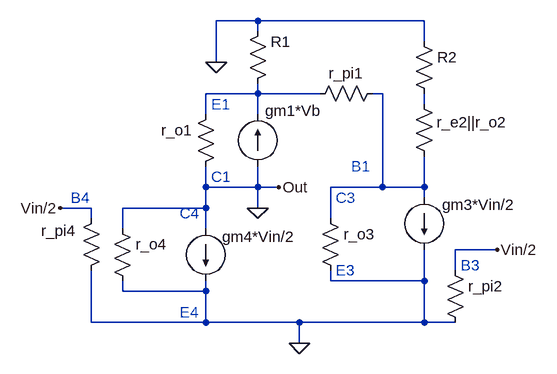
[diagram p0: schematic differential_stage.asc]
differential_stage.asc, the LTspice schematic file:
Version 4
SHEET 1 880 680
WIRE 256 -320 192 -320
WIRE 512 -320 256 -320
WIRE 256 -304 256 -320
WIRE 512 -288 512 -320
WIRE 192 -256 192 -320
WIRE 256 -208 256 -224
WIRE 256 -208 176 -208
WIRE 352 -208 256 -208
WIRE 448 -208 432 -208
WIRE 512 -192 512 -208
WIRE 176 -176 176 -208
WIRE 256 -176 256 -208
WIRE 176 -64 176 -96
WIRE 256 -64 256 -96
WIRE 256 -64 176 -64
WIRE 288 -64 256 -64
WIRE 448 -64 448 -208
WIRE 448 -64 368 -64
WIRE 512 -64 512 -112
WIRE 512 -64 448 -64
WIRE 512 -48 512 -64
WIRE 0 -32 -48 -32
WIRE 176 -32 176 -64
WIRE 176 -32 48 -32
WIRE 256 -32 256 -64
WIRE 0 -16 0 -32
WIRE 368 -16 368 -64
WIRE 48 0 48 -32
WIRE 176 0 176 -32
WIRE 624 32 560 32
WIRE 560 64 560 32
WIRE 368 80 368 64
WIRE 512 80 512 32
WIRE 512 80 368 80
WIRE 48 96 48 80
WIRE 176 96 176 80
WIRE 176 96 48 96
WIRE 0 144 0 64
WIRE 176 144 176 96
WIRE 176 144 0 144
WIRE 320 144 176 144
WIRE 512 144 512 80
WIRE 512 144 320 144
WIRE 560 144 512 144
WIRE 320 176 320 144
FLAG 320 176 0
FLAG 256 -32 0
FLAG 288 -64 Out
FLAG -48 -32 Vin/2
FLAG 624 32 Vin/2
FLAG 192 -256 0
SYMBOL res 16 -32 M0
WINDOW 0 39 35 Left 2
SYMATTR InstName r_pi4
SYMATTR Value ""
SYMBOL res 32 -16 R0
WINDOW 3 36 68 Left 2
SYMATTR Value ""
SYMATTR InstName r_o4
SYMBOL res 192 -192 M0
WINDOW 3 36 68 Left 2
SYMATTR Value ""
SYMATTR InstName r_o1
SYMBOL res 448 -224 R90
WINDOW 0 0 56 VBottom 2
WINDOW 3 32 56 VTop 2
SYMATTR InstName r_pi1
SYMATTR Value ""
SYMBOL res 496 -208 R0
WINDOW 0 35 44 Left 2
SYMATTR InstName r_e2||r_o2
SYMATTR Value ""
SYMBOL current 176 0 R0
WINDOW 0 25 12 Left 2
SYMATTR InstName gm4*Vin/2
SYMATTR Value ""
SYMBOL current 256 -96 M180
WINDOW 0 11 86 Left 2
WINDOW 3 24 0 Left 2
SYMATTR InstName gm1*Vb
SYMATTR Value ""
SYMBOL current 512 -48 R0
WINDOW 0 28 11 Left 2
SYMATTR InstName gm3*Vin/2
SYMATTR Value ""
SYMBOL res 352 -32 R0
SYMATTR InstName r_o3
SYMATTR Value ""
SYMBOL res 544 48 R0
SYMATTR InstName r_pi2
SYMATTR Value ""
SYMBOL res 240 -208 M180
WINDOW 0 36 80 Left 2
WINDOW 3 36 19 Left 2
SYMATTR InstName R1
SYMATTR Value ""
SYMBOL res 496 -304 R0
SYMATTR InstName R2
SYMATTR Value ""
TEXT -32 -48 Left 2 ;B4
TEXT 136 128 Left 2 ;E4
TEXT 136 -24 Left 2 ;C4
TEXT 568 56 Left 2 ;B3
TEXT 376 64 Left 2 ;E3
TEXT 376 -48 Left 2 ;C3
TEXT 184 -80 Left 2 ;C1
TEXT 184 -192 Left 2 ;E1
TEXT 400 -96 Left 2 ;B1

The netlist it stands for:
* differential_stage.asc
r_pi4 Vin/2 0
r_o4 0 0
r_o1 N001 0
r_pi1 N002 N001
r_e2||r_o2 N003 N002
I§gm4*Vin/2 0 0
I§gm1*Vb 0 N001
I§gm3*Vin/2 N002 0
r_o3 N002 0
r_pi2 Vin/2 0
R1 N001 0
R2 0 N003
* B4
* E4
* C4
* B3
* E3
* C3
* C1
* E1
* B1
.backanno
.end